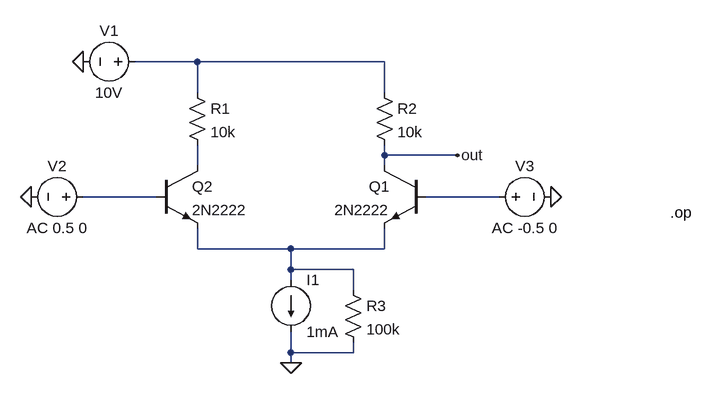
[diagram p0: schematic PNP_Diff_amp.asc]
PNP_Diff_amp.asc, the LTspice schematic file:
Version 4
SHEET 1 916 680
WIRE 64 -80 -32 -80
WIRE 352 -80 64 -80
WIRE 64 -32 64 -80
WIRE 352 -32 352 -80
WIRE 352 64 352 48
WIRE 464 64 352 64
WIRE 64 80 64 48
WIRE 352 80 352 64
WIRE 0 128 -112 128
WIRE 528 128 416 128
WIRE 64 208 64 176
WIRE 208 208 64 208
WIRE 352 208 352 176
WIRE 352 208 208 208
WIRE 208 240 208 208
WIRE 304 240 208 240
WIRE 208 256 208 240
WIRE 304 272 304 240
WIRE 208 368 208 336
WIRE 304 368 304 352
WIRE 304 368 208 368
WIRE 208 384 208 368
FLAG 464 64 out
FLAG -112 -80 0
FLAG 608 128 0
FLAG -192 128 0
FLAG 208 384 0
SYMBOL npn 416 80 M0
SYMATTR InstName Q1
SYMATTR Value 2N2222
SYMBOL npn 0 80 R0
SYMATTR InstName Q2
SYMATTR Value 2N2222
SYMBOL res 48 -48 R0
SYMATTR InstName R1
SYMATTR Value 10k
SYMBOL res 336 -48 R0
SYMATTR InstName R2
SYMATTR Value 10k
SYMBOL voltage -16 -80 R90
WINDOW 0 -32 56 VBottom 2
WINDOW 3 32 56 VTop 2
SYMATTR InstName V1
SYMATTR Value 10V
SYMBOL voltage -96 128 R90
WINDOW 0 -32 56 VBottom 2
WINDOW 3 32 56 VTop 2
SYMATTR InstName V2
SYMATTR Value AC 0.5 0
SYMBOL voltage 512 128 R270
WINDOW 0 32 56 VTop 2
WINDOW 3 -32 56 VBottom 2
SYMATTR InstName V3
SYMATTR Value AC -0.5 0
SYMBOL current 208 256 R0
SYMATTR InstName I1
SYMATTR Value 1mA
SYMBOL res 288 256 R0
SYMATTR InstName R3
SYMATTR Value 100k
TEXT 792 152 Left 2 !.op

The netlist it stands for:
* PNP_Diff_amp.asc
Q1 out N004 N005 0 2N2222
Q2 N002 N003 N005 0 2N2222
R1 N001 N002 10k
R2 N001 out 10k
V1 N001 0 10V
V2 N003 0 AC 0.5 0
V3 N004 0 AC -0.5 0
I1 N005 0 1mA
R3 N005 0 100k
.model NPN NPN
.model PNP PNP
.lib standard.bjt
.op
.backanno
.end